# Altium schematic sheet Sheet1.SchDoc
size A4; SheetNumber: 1; SheetTotal: 1; SPICEModelCacheJCBACRJR: <root> / <DocumentId>JCBACRJR</DocumentId> / <CacheFrame Number="0"> / <Model Name="bas16" Kind="CKT"> / <Text>***************************************************************** / * SPICE2G6 MODEL OF THE DIODE BAS16 (SOT-23)                    * / * REV: 98.1                  DANALYSE GMBH BERLIN (27.07.1998)  * / ***************************************************************** / * jjt 30/10/2000: moved the model into the subckt / * / .SUBCKT BAS16 1 2 / D    3 4 DBAS16 / L1   1 3 0.350N / L2   4 2 0.350N / .MODEL DBAS16 D / + IS  =  2.7838E-09 / + N   =  1.8703 / + RS  =  1.3548 / + EG  =  1.0637 / + XTI =  1.5000 / + CJO =  0.6000E-12 / + VJ  =  0.2000 / + M   =  0.1000 / .ENDS</Text> / </Model> / <Model Name="cout" Kind="CKT"> / <Text>*$ / .SUBCKT Cout 2 4 / R1 2 3 0.0031 / C1 3 4 7.231815776419501E-6 / R3 5 4 5 / R2 2 4 1.3827785868946785E8 / R4 3 26 688888.8888888889 / R6 3 7 688.8888888888889 / C5 7 1 2.1695447329258503E-7 / R7 3 10 68.88888888888889 / C6 10 1 2.1695447329258503E-7 / R8 3 13 6.888888888888889 / C7 13 1 2.1695447329258503E-7 / C2 26 1 2.1695447329258503E-7 / R9 3 28 68888.88888888889 / C3 28 1 2.1695447329258503E-7 / R10 3 29 6888.88888888889 / C4 29 1 2.1695447329258503E-7 / L8 1 5 15p / R24 1 5 0.0093 / L12 5 4 1n / .ENDS</Text> / </Model> / </CacheFrame> / </root>
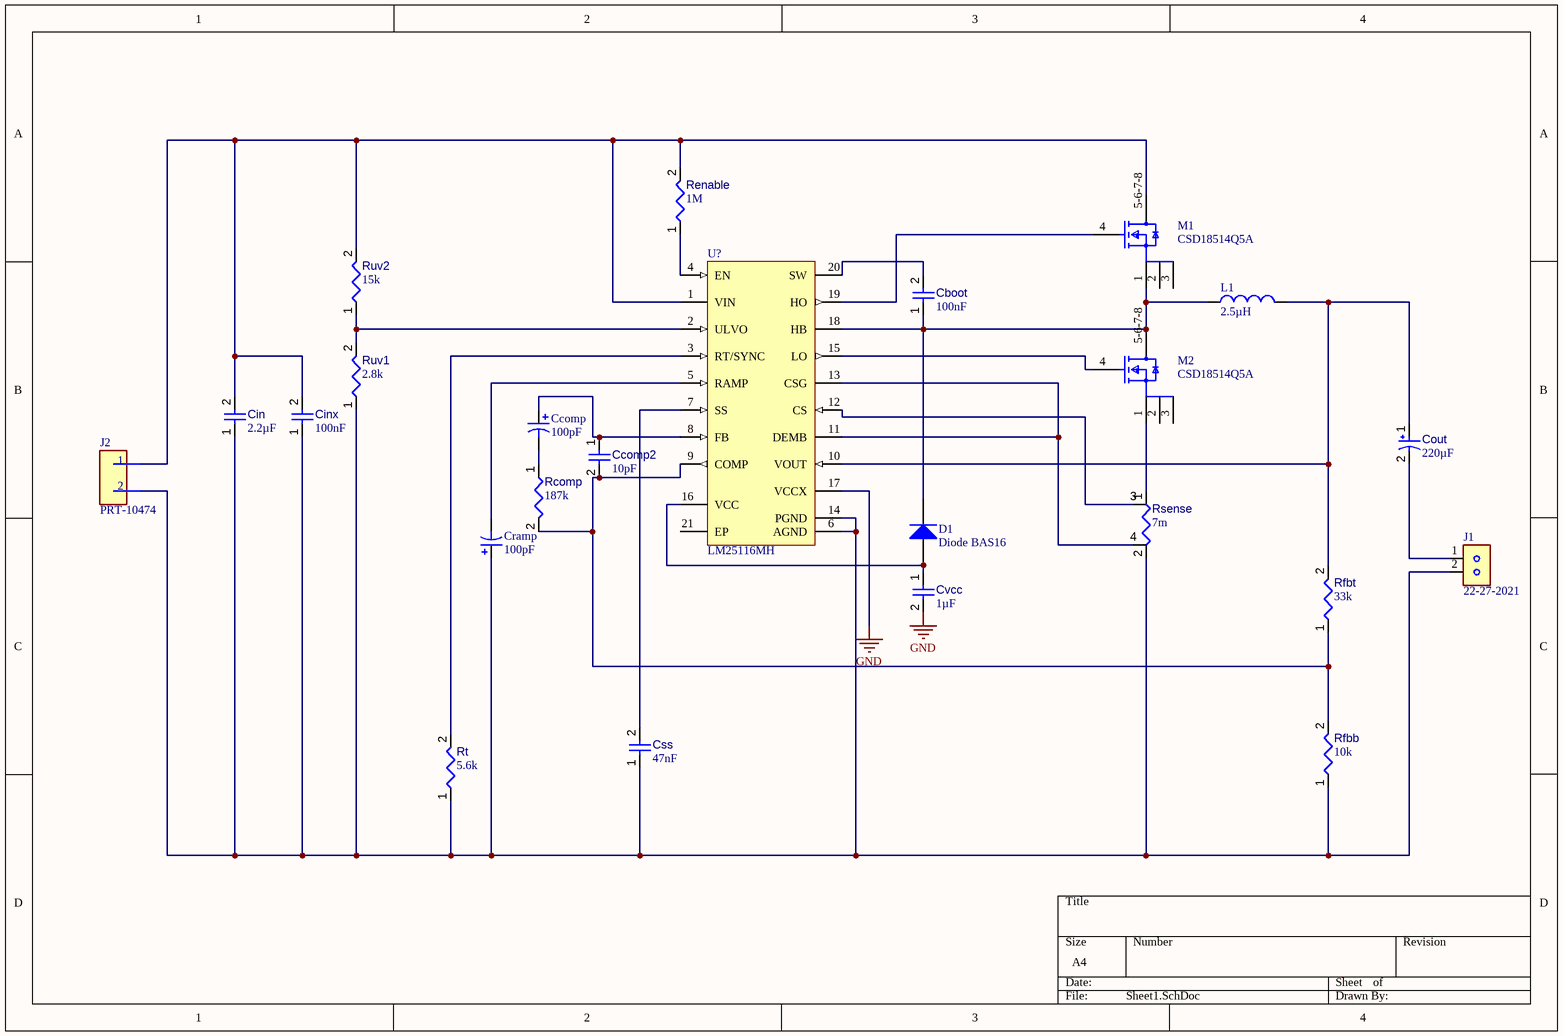
[diagram p0: Sheet1.SchDoc]

## Parts
Cboot  value 100nF  [CAPC2013X95X50LL10T25]  (hidden comment: Capacitor 100 nF +/-10% 50 V 0805)
Ccomp  value 100pF  [C0805]  (hidden comment: Cap Pol3)
Ccomp2  value 10pF  [CAPC1608X90X40ML10T20]  (hidden comment: Capacitor 10 pF +/- 5% 50 V 0603)
Cin  value 2.2µF  (hidden comment: C2012X7R1C225K125AB)
Cinx  value 100nF  [CAPC2013X95X50LL10T25]  (hidden comment: Capacitor 100 nF +/-10% 50 V 0805)
Cout  value 220µF  [CAPPR65-500-1250X1000X1350]  (hidden comment: ECA-1HM221)
Cramp  value 100pF  [C0805]  (hidden comment: Cap Pol3)
Css  value 47nF  [CAPC0402(1005)60_L]  (hidden comment: Capacitor 47nF +/-20% 50V 0402)
Cvcc  value 1µF  [CAPC2013X145X50ML20T25]  (hidden comment: Capacitor 1 uF +/- 10% 25 V 0805)
D1  Diode BAS16  [SOT-23_N]
J1  22-27-2021  [HDRV2W64P254_1X2_580X508X1170P]
J2  PRT-10474  [FP-PRT-10474-MFG]
L1  value 2.5µH  (hidden comment: MSS1038-252NLB)
M1  CSD18514Q5A  [FP-DQJ0008A-MFG]
M2  CSD18514Q5A  [FP-DQJ0008A-MFG]
Rcomp  value 187k  [RESC0402(1005)_L]  (hidden comment: Resistor 187K +/-1 % 0402 63 mW)
Renable  value 1M  [RESC0402(1005)_L]  (hidden comment: Resistor 1M +/-5 % 0402 63 mW)
Rfbb  value 10k  [RESC2013X50X35ML15T15]  (hidden comment: Resistor 10k +/-1% 0805 125 mW)
Rfbt  value 33k  [RESC1005X40X25ML10T10]  (hidden comment: Resistor 33k +/-5% 0402 63 mW)
Rsense  value 7m  [SUSUMU-3216T4A]  (hidden comment: Resistor 7mR +/-1% 1206 63 mW)
Rt  value 5.6k  [RESC0402(1005)_L]  (hidden comment: Resistor 5K6  +/-5 % 0402 63 mW)
Ruv1  value 2.8k  [RESC0402(1005)_L]  (hidden comment: Resistor 2K8  +/-1 % 0402 63 mW)
Ruv2  value 15k  [RESC1005X40X25ML10T10]  (hidden comment: Resistor 15k +/-1% 0402 63 mW)
U?  LM25116MH  [PWP0020A_N]

## Nets
GND: Cvcc.2 U?.17(VCCX)
NetCboot_1: Cboot.1 D1.3(K) L1.1 M1.1(S) M2.5-6-7-8(D) U?.18(HB)
NetCboot_2: Cboot.2 U?.20(SW)
NetCcomp2_2: Ccomp2.2 Rcomp.2 Rfbb.2 Rfbt.1 U?.9(COMP)
NetCcomp_1: Ccomp.1 Ccomp2.1 U?.8(FB)
NetCcomp_2: Ccomp.2 Rcomp.1
NetCin_1: Cin.1 Cinx.1 Cramp.1 Css.1 J1.2 Rfbb.1 Rsense.2(I2) Rt.1 Ruv1.1 U?.6(AGND) U?.14(PGND)
NetCin_2: Cin.2 Cinx.2 M1.5-6-7-8(D) Renable.2 Ruv2.2 U?.1(VIN)
NetCout_1: Cout.1 L1.2 Rfbt.2 U?.10(VOUT)
NetCout_2: Cout.2 J1.1
NetCramp_2: Cramp.2 U?.5(RAMP)
NetCss_2: Css.2 U?.7(SS)
NetCvcc_1: Cvcc.1 D1.1(A) U?.16(VCC)
NetM1_4: M1.4(G) U?.19(HO)
NetM2_1: M2.1(S) Rsense.1(I1)
NetM2_4: M2.4(G) U?.15(LO)
NetRenable_1: Renable.1 U?.4(EN)
NetRsense_3: Rsense.3(E1) U?.12(CS)
NetRsense_4: Rsense.4(E2) U?.11(DEMB) U?.13(CSG)
NetRt_2: Rt.2 U?.3(RT/SYNC)
NetRuv1_2: Ruv1.2 Ruv2.1 U?.2(ULVO)

Not connected (* = marked no-connect by the designer): M1 2(S) 3(S); M2 2(S) 3(S); U? 21(EP)

## Notes on the sheet
- (in symbol CMP-157536-000001-1) 1; 2

## Library data of the parts
Cboot Cinx = CMP-001-00018-6: Chip Capacitor, 100 nF, +/- 10%, 50 V, 0805 (2012 Metric); Capacitor Type: Ceramic; Voltage Rating: 50V; Pins: 2; Max Operating Temperature: 125°C; Min Operating Temperature: -55°C; Mounting Technology: SM; Case/Package: 0805; RoHS Compliant: True; Tolerance: 10%
Ccomp Cramp = CMP-001-00095-1: Polarized Capacitor (Surface Mount); Signal Integrity: Cap Pol; Component Type: Standard; Case/Package: Chip Capacitor; Source: Miscellaneous Devices.SchLib; Publisher: Altium Limited; Published: 8-Jun-2000; PackageReference: C0805; LatestRevisionDate: 29-May-2009; Pins: 2; LatestRevisionNote: IPC-7351 Footprint Added.; Design Item ID: Cap Pol3
Ccomp2 = CMP-001-00014-6: Chip Capacitor, 10 pF, +/- 5%, 50 V, 0603 (1608 Metric); Capacitor Type: Ceramic; Voltage Rating: 50V; RoHS Compliant: True; Case/Package: 0603; Max Operating Temperature: 125°C; Pins: 2; Tolerance: 5%; Mounting Technology: SM; Min Operating Temperature: -55°C
Cin = CMP-001-00108-1: C Series 0805 2.2 uF 16 V ±10 % Tolerance X7R SMT Multilayer Ceramic Capacitor; Tolerance: 10%; Voltage Rating: 16V; Mounting Technology: Surface Mount; Pins: 2; Min Operating Temperature: -55°C; Case/Package: 0805; Max Operating Temperature: 125°C
Cout = CMP-001-00028-7: Aluminum Electrolytic Capacitor, 220 uF, +/- 20%, 50 V, -40 to 85 degC, 2-Pin THD, RoHS, Bulk; Manufacturer: Panasonic; Ripple Current (AC): 400mA; Voltage Rating: 50V; Case/Package: Radial; Packaging: Bulk; Package Quantity: 200; Min Operating Temperature: -40°C; Datasheet Version: Mar-16; Package Reference: CAPPR65-500-1250X1000X1350; Mounting Technology: TH; Ripple Current: 400mA; Pins: 2; Package Description: 2-Pin Radial Lead, Dia 10 mm, Body Length 12.5 mm; RoHS Compliant: True; Max Operating Temperature: 85°C; Lead Pitch: 5mm; Tolerance: 20%; Manufacturer URL: http://www.panasonic.com/; Diameter: 10mm; Capacitor Type: Electrolytic; Datasheet URL: http://industrial.panasonic.com/cdbs/www-data/pdf/RDF0000/DMF0000COL68.pdf
Css = CMP-001-00071-4: Chip Capacitor, 47nF +/-20%, 50V, 0402, Thickness 0.6 mm; Tolerance: 20%; Pins: 2; Mounting Technology: SMT; Voltage Rating: 50V; Case/Package: 0402; Max Operating Temperature: 85°C; Min Operating Temperature: -55°C
Cvcc = CMP-001-00010-6: Chip Capacitor, 1 uF, +/-10%, 25 V, 0805 (2012 Metric); Capacitor Type: Ceramic; Voltage Rating: 25V; RoHS Compliant: True; Pins: 2; Mounting Technology: SM; Max Operating Temperature: 125°C; Min Operating Temperature: -55°C; Tolerance: 10%; Case/Package: 0805
D1 = CMP-004-00112-1: Silicon Switching Diode for High-Speed Switching; Note: Pin 2 is not connected and not drawn.; LatestRevisionNote: IPC-7351 Footprint Added.; ComponentLink1Description: Manufacturer Link; LatestRevisionDate: 29-May-2009; Design Item ID: Diode BAS16; Published: 21-Mar-2003; Component Type: Standard; Source: Miscellaneous Devices.SchLib; Publisher: Altium Limited; Case/Package: 3-Pin SOT-23 Package 0.95 mm Pitch, 2.5 mm Lead Span; ComponentLink1URL: http://www.infineon.com/; PackageVersion: Sep-2001; PackageReference: SOT-23; ComponentLink2Description: Datasheet; Pins: 2; DatasheetVersion: Oct-1999; ComponentLink2URL: http://www.infineon.com/upload/Document/cmc_upload/documents/012/5331/bas16series.pdf
J1 = CMP-002-00606-1: Connector Wire to Board Header 2 Position 2.54mm Solder Straight Thru-Hole Ba; Availability: Unavailable; Design Item ID: 22-27-2021; Case/Package: None; MP: 22-27-2021; Price: None; Pins: 2; Component Type: Standard; Value: *; Source: 22-27-2021.SchLib
J2 = CMP-157536-000001-1: XT60 CONNECTORS MALE/FEMALE PAIR
L1 = CMP-006-00402-1: General Purpose Inductor, 2.5uH, 30%, 1 Element, Ferrite-Core, SMD, 4039; Max Current Rating: 6.65A; Self Resonant Frequency: 61MHz; Tolerance: 30%; Max Operating Temperature: 85°C; Case/Package: SMD/SMT; Min Operating Temperature: -40°C
M1 M2 = CMP-011-00052-1: 40-V, N channel NexFET™ power MOSFET, single SON 5 mm x 6 mm, 4.9 mOhm 8-VSONP -55 to 150; Pins: 8; Max Operating Temperature: 150°C; Min Operating Temperature: -55°C
Rcomp = CMP-009-00170-3: Chip Resistor, 187 kOhms, +/-1 %, 63 mW, -55 to 155 degC, 0402; Power: 63mW; Tolerance: 1%; Case/Package: 0402; Min Operating Temperature: -55°C; Pins: 2; Max Operating Temperature: 155°C
Renable = CMP-009-00151-3: Chip Resistor, 1 MOhms, +/-5 %, 63 mW, -55 to 155 degC, 0402; Power: 63mW; Tolerance: 5%; Pins: 2; Min Operating Temperature: -55°C; Case/Package: 0402; Max Operating Temperature: 155°C
Rfbb = CMP-009-00018-5: Chip Resistor, 10 KOhm, +/- 1%, 125 mW, -55 to 155 degC, 0805 (2012 Metric); Power: 125mW; Voltage Rating: 150V; Tolerance: 1%; Pins: 2; Min Operating Temperature: -55°C; Case/Package: 0805; Max Operating Temperature: 155°C; RoHS Compliant: True; Mounting Technology: SM
Rfbt = CMP-009-00028-5: Chip Resistor, 33 KOhm, +/- 5%, 0.063 W, -55 to 155 degC, 0402 (1005 Metric); Power: 63mW; Tolerance: 5%; Case/Package: 0402; Mounting Technology: SM; Min Operating Temperature: -55°C; Max Operating Temperature: 155°C; Pins: 2; RoHS Compliant: True
Rsense = CMP-009-00119-3: Chip Resistor, 0,007 Ohms, +/-1%, 63 mW, -55 to 155 degC, 1206; Tolerance: 1%; Max Operating Temperature: 155°C; Min Operating Temperature: -55°C; Pins: 4; Case/Package: 1206
Rt = CMP-009-00136-3: Chip Resistor, 5,6 kOhms, +/-5 %, 63 mW, -55 to 155 degC, 0402; Power: 63mW; Tolerance: 5%; Max Operating Temperature: 155°C; Case/Package: 0402; Min Operating Temperature: -55°C; Pins: 2
Ruv1 = CMP-009-00156-3: Chip Resistor, 2,8 kOhms, +/-1 %, 63 mW, -55 to 155 degC, 0402; Tolerance: 1%; Power: 63mW; Case/Package: 0402; Pins: 2
Ruv2 = CMP-009-00026-5: Chip Resistor, 15 KOhm, +/- 1%, 0.063 W, -55 to 155 degC, 0402 (1005 Metric); Power: 63mW; Min Operating Temperature: -55°C; Tolerance: 1%; Max Operating Temperature: 155°C; Mounting Technology: SM; Case/Package: 0402; RoHS Compliant: True; Pins: 2
U? = CMP-00024-00007-1: 6-42V Wide Vin, Current Mode Synchronous Buck Controller 20-HTSSOP -40 to 125; Min Operating Temperature: -40°C; Case/Package: HTSSOP EP; Mounting Technology: Surface Mount; Max Operating Temperature: 125°C; Pins: 20